# EAGLE design DMP (EAGLE 9.6.2)
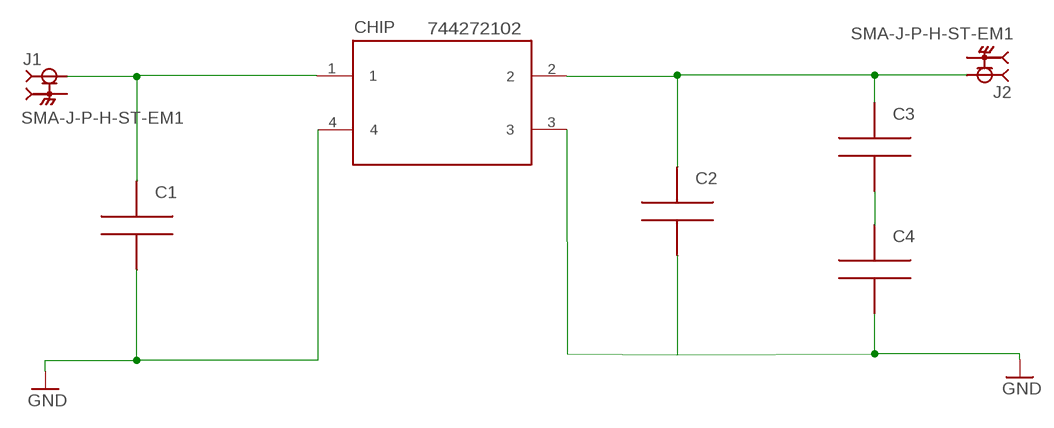
[diagram p0: schematic, sheet 1]

## Parts
C1  CAPA1206  [FGJGFN]
C2  CAPA1206  [FGJGFN]
C3  CAPA1206  [FGJGFN]
C4  CAPA1206  [FGJGFN]
CHIP  CHOKE  [CHOKE]
J1  SMA-J-P-H-ST-EM1  [SAMTEC_SMA-J-P-H-ST-EM1]
J2  SMA-J-P-H-ST-EM1  [SAMTEC_SMA-J-P-H-ST-EM1]

## Nets
GND: C1.1 C2.1 C4.1 CHIP.3 CHIP.4
N$3: C1.2 CHIP.1 J1.1
N$4: C2.2 C3.2 CHIP.2 J2.1
N$5: C3.1 C4.2
Unconnected: J1.2_1 J1.2_2 J1.3_1 J1.3_2 J2.2_1 J2.2_2 J2.3_1 J2.3_2

## Notes on the sheet
- C1=1500pF

## Library data of the parts
C1-C4 = capa:CAPA
CHIP = CHOKE:CHOKE
J1 J2 = SMA:SMA-J-P-H-ST-EM1: SMA Connector Jack, Female Socket 50Ohm Board Edge, End Launch Solder; MANUFACTURER: Samtec; MAXIMUM_PACKAGE_HEIGHT: 3.675mm; PARTREV: G; STANDARD: Manufacturer Recommendations

## Board
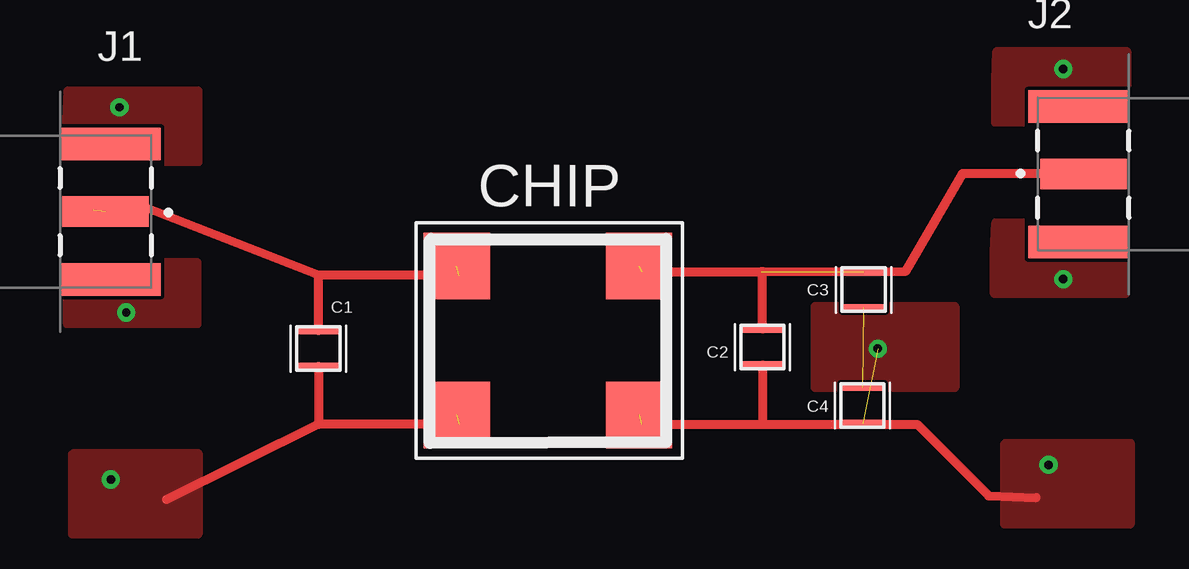
[diagram p1: board, top side]
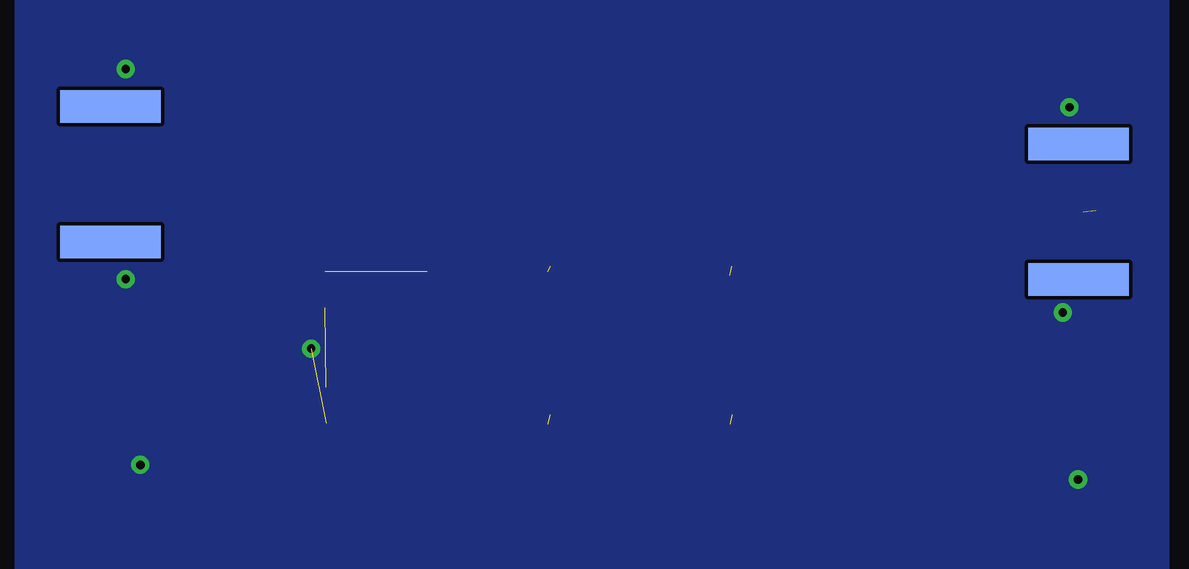
[diagram p2: board, bottom side, seen from below]

No outline drawn. Coordinates in mm, seen from the top.
Copper layers (1*16): Top 0.035mm / dielectric 1.5mm / Bottom 0.035mm
Design rules "default": minimum track width 6mil, minimum drill 0.35mm, track to track 6mil, track to pad 6mil, pad to pad 6mil, via to via 6mil, smd to smd 6mil, copper to edge 40mil, drill to drill 6mil, minimum pad ring 10mil, minimum via ring 8mil, stop-mask expansion 4mil, vias tented up to drill 0mil, thermal gap 10mil

### Footprints (pad centres in the part's own frame; a part is rotated, then mirrored left to right if it is on the bottom)
FGJGFN = smd 0.3 x 1.8: 1 -0.8,0; 2 0.7,0
CHOKE = smd 2.76 x 2.76: 1 -3.79,2.54; 2 3.81,2.54; 3 3.81,-3.66; 4 -3.79,-3.66
SAMTEC_SMA-J-P-H-ST-EM1 = smd 1.27 x 3.6: 1 0,0 | smd 1.35 x 4.2: 2_1 -2.825,0.2; 3_1 2.825,0.2 | smd 1.35 x 4.2 bottom: 2_2 -2.825,0.2; 3_2 2.825,0.2

### Placement (x,y rotation side)
C1  29.15,22.45 90 top
C2  47.66,22.51 90 top
C3  51.88,24.9 90 top
C4  51.83,20.08 90 top
CHIP  38.7,23.29 0 top
J1  20.27,28.1 270 top
J2  61.03,29.66 90 top

### Tracks (layer width: path | path; a pad name or v marks a point on that pad's centre or on a via)
GND  (via drill 0.35)  (3 unrouted)
  Top 0.38: 35.01,19.24 29.15,19.24 | C1.1 29.15,19.24 | 42.61,19.24 47.63,19.24 47.66,19.27 | C2.1 47.66,19.27 | 47.66,19.27 47.66,19.24 54.1,19.24 57.08,16.26 59.05,16.18 | 29.15,19.24 22.81,16.1
  other vias: 20.49,16.94 21.13,23.9 52.46,22.39 60.19,34.04 60.19,25.29 59.58,17.55 20.85,32.45
  pour Top (no thermals): 49.85,24.15 55.67,24.15 55.67,20.77 49.85,20.77
  pour Top (no thermals): 18.71,33.13 24.11,33.13 24.11,30.17 18.65,30.17 18.65,31.92
  pour Top (no thermals): 18.68,25.99 24.07,25.99 24.07,23.42 18.68,23.42
  pour Top (no thermals): 18.95,18.03 24.13,18.03 24.13,14.66 18.9,14.66 18.9,17.98
  pour Top (no thermals): 57.8,18.45 62.98,18.45 62.98,15.08 57.75,15.08 57.75,18.4
  pour Top (no thermals): 57.43,34.78 62.83,34.78 62.83,31.82 57.37,31.82 57.37,33.57
  pour Top: 57.38,27.64 62.78,27.64 62.78,24.68 57.32,24.68 57.32,26.43
  pour Top (no thermals): 57.38,27.64 62.78,27.64 62.78,24.68 57.32,24.68 57.32,26.43
  pour Bottom: 16.85,38.77 64.64,38.77 64.64,12.68 16.85,12.68
N$3  (2 unrouted)
  Top 0.38: 35.01,25.44 29.15,25.44 | C1.2 29.15,25.44 | 29.15,25.44 21.95,28.26 19.6,28.21 19.55,28.21 19.76,28.16
N$4  (2 unrouted)
  Top 0.38: 42.61,25.6 47.62,25.6 | 47.62,25.6 47.66,25.6 C2.2 | 47.62,25.59 47.62,25.6 | 47.62,25.6 53.64,25.62 56,29.69 60.05,29.69 60.05,29.66 | 60.05,29.66 60.05,29.61 | J2.1 60.05,29.66
N$5  (1 unrouted)